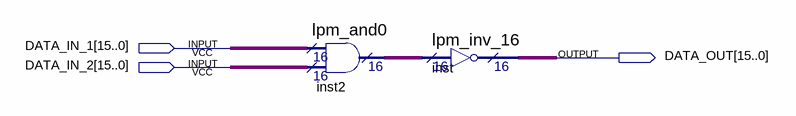
[diagram p0: schematic sheet]
// Quartus schematic oper_nand.bdf as structural Verilog: 2 symbols, 3 pins
module oper_nand (
  input  [15:0] DATA_IN_1,
  input  [15:0] DATA_IN_2,
  output [15:0] DATA_OUT
);

  wire [15:0] inst2_result;

  lpm_and0 inst2 (.data0x(DATA_IN_1), .data1x(DATA_IN_2), .result(inst2_result));
  lpm_inv_16 inst (.data(inst2_result), .result(DATA_OUT));
endmodule
